# Altium project Higro.PrjPcb
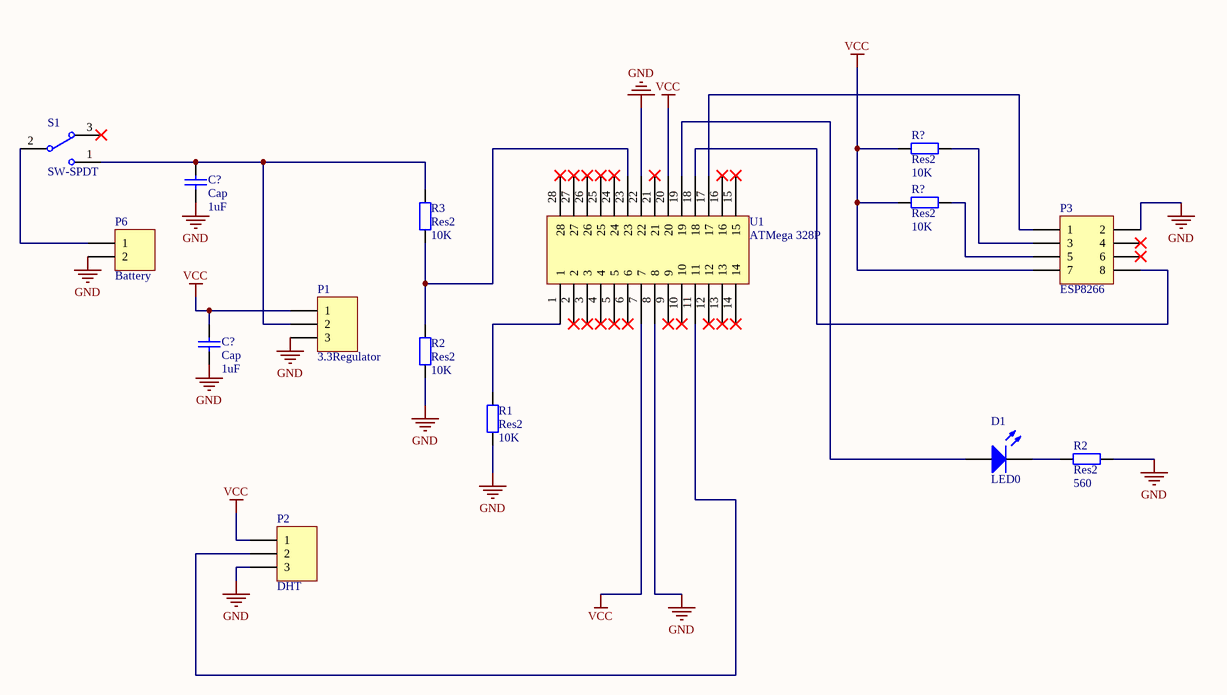
[diagram p0: HigroIoT.SchDoc]
1 sheet, 15 parts. Net scope: global (net labels, ports and power ports of the same name join across sheets).

## Sheet HigroIoT.SchDoc
size A4

### Parts
(Parts that share a designator on the sheet are numbered #1, #2 ... from top to bottom, then left to right.)
C?#1  Cap  value 1uF  [RAD-0.3]
C?#2  Cap  value 1uF  [RAD-0.3]
D1  LED0  [LED-0]
P1  3.3Regulator  [HDR1X3]
P2  DHT  [HDR1X3]
P3  ESP8266  [HDR2X4]
P6  Battery  [HDR1X2]
R1  Res2  value 10K  [AXIAL-0.4]
R2#1  Res2  value 10K  [AXIAL-0.4]
R2#2  Res2  value 560  [AXIAL-0.4]
R3  Res2  value 10K  [AXIAL-0.4]
R?#1  Res2  value 10K  [AXIAL-0.4]
R?#2  Res2  value 10K  [AXIAL-0.4]
S1  SW-SPDT  [SW_ON]
U1  ATMega 328P  [CONN28]

### Nets
GND: C?#1.1 C?#2.1 P1.3 P2.3 P3.2 P6.2 R1.2 R2#1.2 R2#2.2 U1.8 U1.22
VCC: C?#2.2 P1.1 P2.1 P3.7 R?#1.1 R?#2.1 U1.7 U1.20
NetC?#1_2: C?#1.2 P1.2 R3.1 S1.1
NetD1_1: D1.1(A) U1.19
NetD1_2: D1.2(K) R2#2.1
NetP2_2: P2.2 U1.11
NetP3_1: P3.1 U1.17
NetP3_3: P3.3 R?#1.2
NetP3_5: P3.5 R?#2.2
NetP3_8: P3.8 U1.18
NetP6_1: P6.1 S1.2
NetR1_1: R1.1 U1.1
NetR2#1_1: R2#1.1 R3.2 U1.23

Not connected (* = marked no-connect by the designer): P3 4* 6*; S1 3*; U1 2* 3* 4* 5* 6* 9* 10* 12* 13* 14* 15* 16* 21* 24* 25* 26* 27* 28*

### Library data of the parts
C?#1 C?#2 = Cap: Capacitor; Published: 8-Jun-2000; LatestRevisionDate: 17-Jul-2002; LatestRevisionNote: Re-released for DXP Platform.; PackageReference: RAD-0.3; Publisher: Altium Limited; PackageDescription: Radial Cap, Thru-Hole; 2 Leads; 0.3 in Pin Spacing
D1 = LED0: Typical INFRARED GaAs LED; Published: 8-Jun-2000; LatestRevisionDate: 08-Jul-2005; LatestRevisionNote: Mech Layer 1 removed.; PackageReference: LED-0; Publisher: Altium Limited; PackageDescription: LED; 2 Leads
P1 P2 = Header 3: Header, 3-Pin; LatestRevisionDate: 17-Jul-2002; LatestRevisionNote: Re-released for DXP Platform.; Publisher: Altium Limited
P3 = Header 4X2: Header, 4-Pin, Dual row; LatestRevisionDate: 17-Jul-2002; LatestRevisionNote: Re-released for DXP Platform.; Publisher: Altium Limited
P6 = Header 2: Header, 2-Pin; LatestRevisionDate: 17-Jul-2002; LatestRevisionNote: Re-released for DXP Platform.; Publisher: Altium Limited
R1 R2#1 R2#2 R3 R?#1 R?#2 = Res2: Resistor; Published: 8-Jun-2000; LatestRevisionDate: 17-Jul-2002; LatestRevisionNote: Re-released for DXP Platform.; PackageReference: AXIAL-0.4; Publisher: Altium Limited; PackageDescription: Axial Device, Thru-Hole; 2 Leads; 0.4 in Pin Spacing
S1 = SW-SPDT: SPDT Subminiature Toggle Switch, Right Angle Mounting, Vertical Actuation; Published: 24-Mar-1999; LatestRevisionDate: 17-Dec-2003; LatestRevisionNote: Schematic revised, PCB Footprint replaced.; DatasheetVersion: 05-Dec-2000; PackageReference: TL36WW15050; Publisher: Altium Limited; PackageDescription: Switch; 4 Leads; ComponentLink1Description: Manufacturer Link; ComponentLink1URL: http://www.apem.com
U1 = Component_1